# Altium schematic sheet hücre_gerilim_okuma.SchDoc
size A4
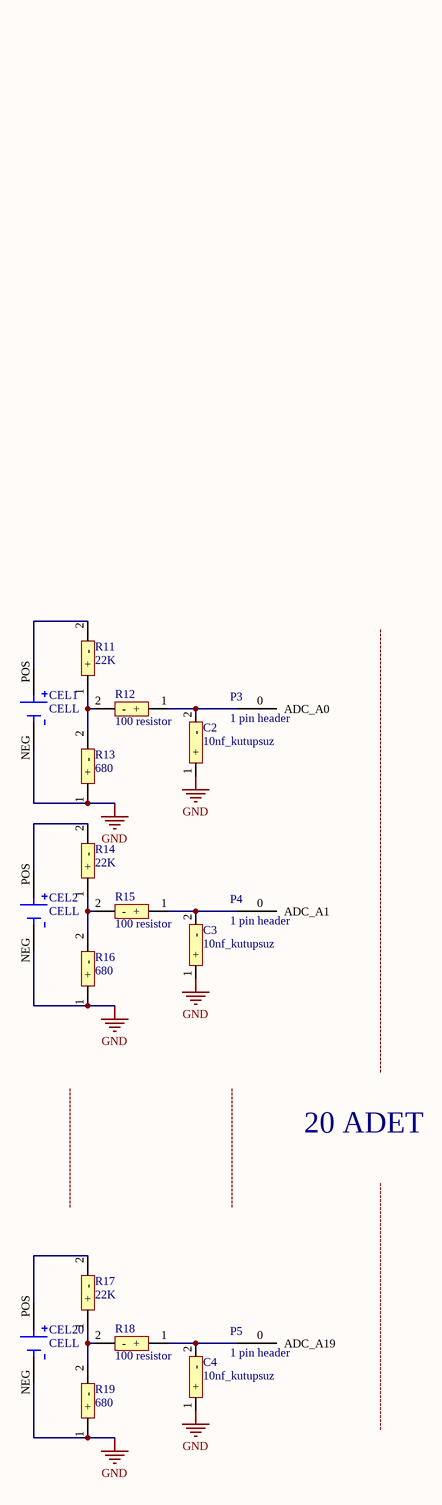
[diagram p0: hücre_gerilim_okuma.SchDoc]

## Parts
C2  10nf_kutupsuz  [10NF_KUTUPSUZ]
C3  10nf_kutupsuz  [10NF_KUTUPSUZ]
C4  10nf_kutupsuz  [10NF_KUTUPSUZ]
CEL1  CELL  [BAT_BA2AAPC-UL94V-0]
CEL2  CELL  [BAT_BA2AAPC-UL94V-0]
CEL20  CELL  [BAT_BA2AAPC-UL94V-0]
P3  1 pin header  [1pinheader]
P4  1 pin header  [1pinheader]
P5  1 pin header  [1pinheader]
R11  22K  [100 resistor]
R12  100 resistor  [100 resistor]
R13  680  [100 resistor]
R14  22K  [100 resistor]
R15  100 resistor  [100 resistor]
R16  680  [100 resistor]
R17  22K  [100 resistor]
R18  100 resistor  [100 resistor]
R19  680  [100 resistor]

## Nets
GND: C2.1(+) C3.1(+) C4.1(+) CEL1.NEG CEL2.NEG CEL20.NEG R13.1(+) R16.1(+) R19.1(+)
NetC2_2: C2.2(-) P3.0(ADC_A0) R12.1(+)
NetC3_2: C3.2(-) P4.0(ADC_A1) R15.1(+)
NetC4_2: C4.2(-) P5.0(ADC_A19) R18.1(+)
NetCEL1_POS: CEL1.POS R11.2(-)
NetCEL2_POS: CEL2.POS R14.2(-)
NetCEL20_POS: CEL20.POS R17.2(-)
NetR11_1: R11.1(+) R12.2(-) R13.2(-)
NetR14_1: R14.1(+) R15.2(-) R16.2(-)
NetR17_1: R17.1(+) R18.2(-) R19.2(-)

## Notes on the sheet
- 20 ADET
- Labels drawn without touching a wire or pin: ------------------------------, --------------------------------------------------------------, ---------------------------------------------------------------------------------------------------------------

## Library data of the parts
CEL1 CEL2 CEL20 = CELL: BATTERY HOLDER AA 2 CELL SMD TAB; MF: MPD; MP: BA2AAPC-UL94V-0; Value: *; Price: None; Package: None; Check_prices: https://www.snapeda.com/parts/BA2AAPC-UL94V-0/MPD/view-part/4389111/?ref=eda; Availability: Warning; SnapEDA_Link: https://www.snapeda.com/parts/BA2AAPC-UL94V-0/MPD/view-part/4389111/?ref=snap; Purchase-URL: https://pricing.snapeda.com/search/part/BA2AAPC-UL94V-0/?ref=eda
R11 R13 R14 R16 R17 R19 = 100 resistor